# EAGLE design Sch_PowerSupply (EAGLE 7.4.0)
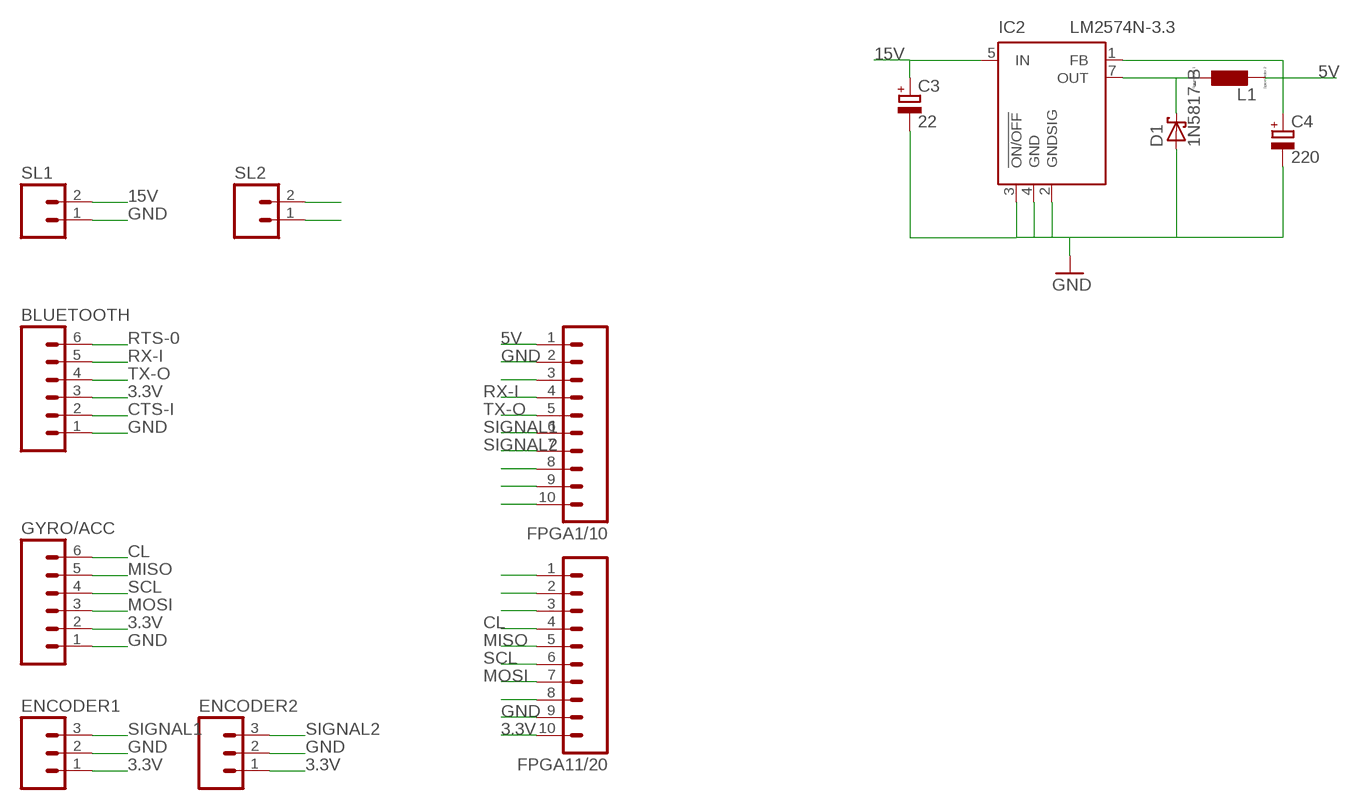
[diagram p0: schematic, sheet 1]

## Parts
BLUETOOTH  M06  [06P]
C3  22  CPOL-EUE5-8.5  [E5-8,5]
C4  220  CPOL-EUE5-8.5  [E5-8,5]
D1  1N5817-B  [DO41-7.6]
ENCODER1  M03  [03P]
ENCODER2  M03  [03P]
FPGA1/10  M10  [10P]
FPGA11/20  M10  [10P]
GYRO/ACC  M06  [06P]
IC2  LM2574N-3.3  [DIL08]
L1  L0204/7  [0204/7]
SL1  M02  [02P]
SL2  M02  [02P]

## Nets
3.3V: BLUETOOTH.3 ENCODER1.1 ENCODER2.1 FPGA11/20.10 GYRO/ACC.2
5V: C4.+ FPGA1/10.1 IC2.1(FB) L1.2 SL2.2
15V: C3.+ IC2.5(IN) SL1.2
CL: FPGA11/20.4 GYRO/ACC.6
CTS-I: BLUETOOTH.2
GND: BLUETOOTH.1 C3.- C4.- D1.A ENCODER1.2 ENCODER2.2 FPGA1/10.2 FPGA11/20.9 GYRO/ACC.1 IC2.2(GNDSIG) IC2.3(!ON/OFF) IC2.4(GND) SL1.1 SL2.1
MISO: FPGA11/20.5 GYRO/ACC.5
MOSI: FPGA11/20.7 GYRO/ACC.3
N$3: D1.C IC2.7(OUT) L1.1
N$7: FPGA11/20.3
N$8: FPGA11/20.2
N$9: FPGA11/20.1
N$10: FPGA1/10.10
N$11: FPGA1/10.9
N$12: FPGA1/10.8
N$16: FPGA1/10.3
N$31: FPGA11/20.8
RTS-0: BLUETOOTH.6
RX-I: BLUETOOTH.5 FPGA1/10.4
SCL: FPGA11/20.6 GYRO/ACC.4
SIGNAL1: ENCODER1.3 FPGA1/10.6
SIGNAL2: ENCODER2.3 FPGA1/10.7
TX-O: BLUETOOTH.4 FPGA1/10.5

## Library data of the parts
BLUETOOTH GYRO/ACC = con-amp-quick:M06: AMP QUICK CONNECTOR; OC_FARNELL: unknown; OC_NEWARK: unknown
C3 C4 = rcl:CPOL-EU: POLARIZED CAPACITOR, European symbol
D1 = diode:1N581*: 1.0A SCHOTTKY BARRIER RECTIFIER Source: http://www.diodes.com/datasheets/ds23001.pdf
ENCODER1 ENCODER2 = con-amp-quick:M03: AMP QUICK CONNECTOR; OC_FARNELL: unknown; OC_NEWARK: unknown
FPGA1/10 FPGA11/20 = con-amp-quick:M10: AMP QUICK CONNECTOR; OC_FARNELL: unknown; OC_NEWARK: unknown
IC2 = linear:LM2574?-*: SIMPLE SWITCHER 0.5A Step-Down Voltage Regulator Source: http://cache.national.com/ds/LM/LM2574.pdf
L1 = eagle-ltspice:L: INDUCTOR, European symbol; SPICEMODEL: NONE; SPICEPREFIX: L
SL1 SL2 = con-amp-quick:M02: AMP QUICK CONNECTOR; OC_FARNELL: unknown; OC_NEWARK: unknown

## Board
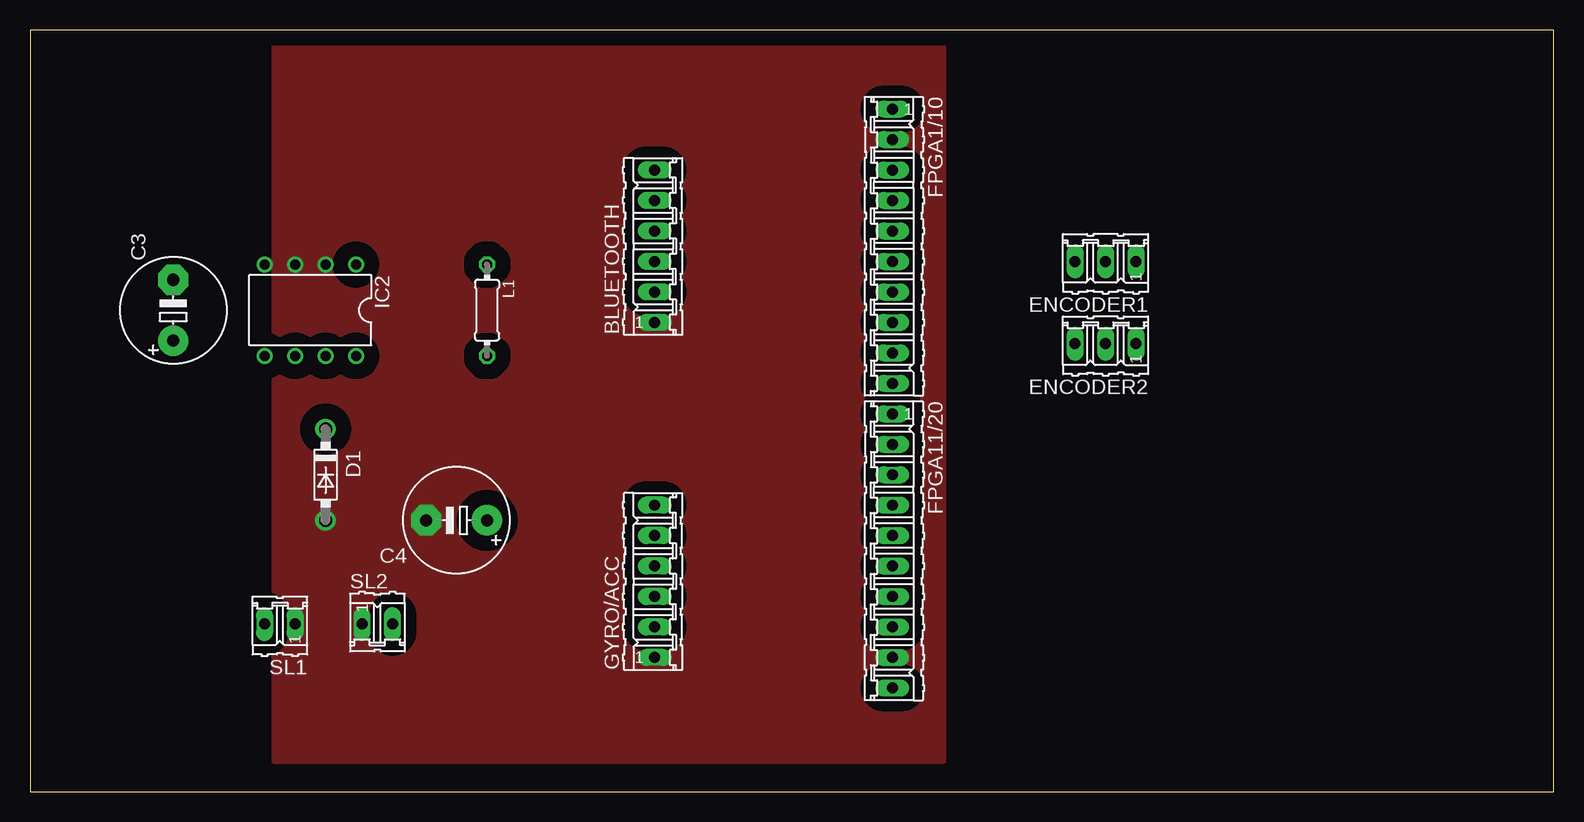
[diagram p1: board, top side]
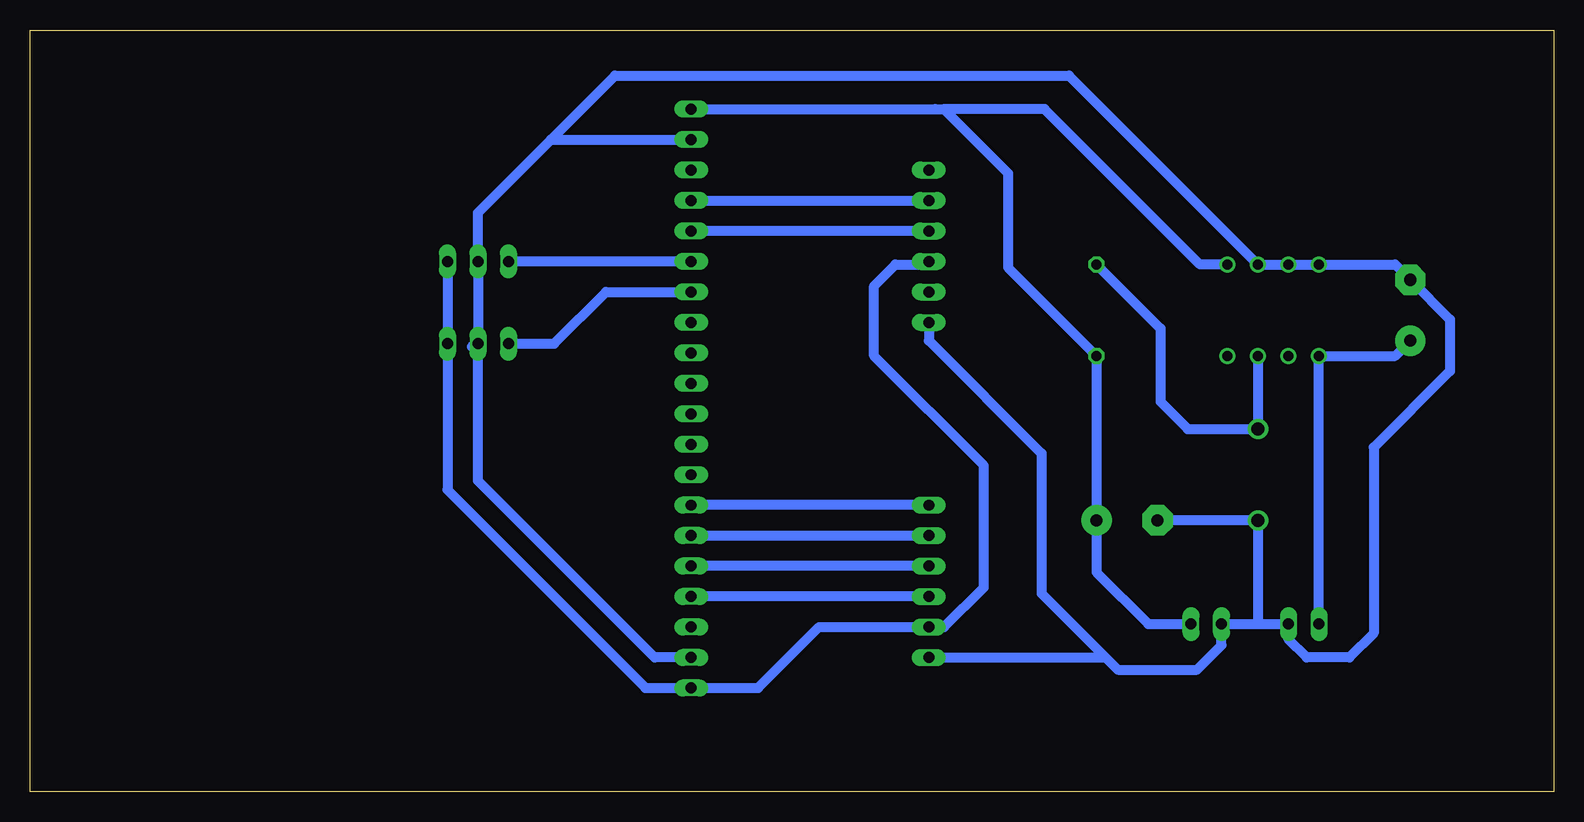
[diagram p2: board, bottom side, seen from below]

Size 127 x 63.5 mm. Coordinates in mm from the lower left corner, seen from the top.
Outline: 0,0 127,0 127,63.5 0,63.5 0,0
Copper layers (1*16): Top 0.035mm / dielectric 1.5mm / Bottom 0.035mm
Design rules "default": minimum track width 10mil, minimum drill 24mil, track to track 8mil, track to pad 8mil, pad to pad 8mil, via to via 8mil, smd to smd 8mil, copper to edge 40mil, drill to drill 8mil, minimum pad ring 10mil, minimum via ring 8mil, stop-mask expansion 4mil, vias tented up to drill 0mil, thermal gap 10mil

### Footprints (pad centres in the part's own frame; a part is rotated, then mirrored left to right if it is on the bottom)
06P = drill 0.914 long: 1 -6.35,0; 2 -3.81,0; 3 -1.27,0; 4 1.27,0; 5 3.81,0; 6 6.35,0
E5-8,5 = drill 1.016 pad 2.54: + -2.54,0 | drill 1.016 pad 2.54 octagon: - 2.54,0
DO41-7.6 = drill 1.1 pad 1.7: A 3.81,0; C -3.81,0
03P = drill 0.914 long: 1 -2.54,0; 2 0,0; 3 2.54,0
10P = drill 0.914 long: 1 -11.43,0; 2 -8.89,0; 3 -6.35,0; 4 -3.81,0; 5 -1.27,0; 6 1.27,0; 7 3.81,0; 8 6.35,0; 9 8.89,0; 10 11.43,0
DIL08 = drill 0.813 pad 1.27: 1 -3.81,-3.81; 2 -1.27,-3.81; 3 1.27,-3.81; 4 3.81,-3.81; 5 3.81,3.81; 6 1.27,3.81; 7 -1.27,3.81; 8 -3.81,3.81
0204/7 = drill 0.813 octagon: 1 -3.81,0; 2 3.81,0
02P = drill 0.914 long: 1 -1.27,0; 2 1.27,0

### Placement (x,y rotation side)
BLUETOOTH  52.07,45.47 90 top
C3  11.94,40.13 90 top
C4  35.56,22.61 180 top
D1  24.64,26.42 270 top
ENCODER1  89.66,44.2 180 top
ENCODER2  89.66,37.34 180 top
FPGA1/10  71.88,45.47 270 top
FPGA11/20  71.88,20.07 270 top
GYRO/ACC  52.07,17.53 90 top
IC2  23.37,40.13 180 top
L1  38.1,40.13 270 top
SL1  20.83,13.97 180 top
SL2  28.96,13.97 0 top

### Tracks (layer width: path | path; a pad name or v marks a point on that pad's centre or on a via)
3.3V
  Bottom 0.813: BLUETOOTH.3 52.32,43.94 54.86,43.94 56.64,42.16 56.64,36.32 47.5,27.18 47.5,17.02 50.8,13.72 GYRO/ACC.2 52.32,13.46 52.58,13.46 52.83,13.72 61.21,13.72 66.29,8.64 FPGA11/20.10 75.69,8.64 92.2,25.15 ENCODER2.1 ENCODER1.1
5V
  Bottom 0.813: FPGA1/10.1 51.56,56.9 50.8,56.9 | 50.8,56.9 45.47,51.56 45.47,43.69 L1.2 C4.+ 38.1,18.29 33.78,13.97 SL2.2 | IC2.1 29.46,43.94 42.42,56.9 50.8,56.9
15V
  Bottom 0.813: SL1.2 IC2.5 13.21,36.32 C3.+
CL
  Bottom 0.813: GYRO/ACC.6 FPGA11/20.4
GND
  Bottom 0.813: 83.57,54.36 89.66,48.26 ENCODER1.2 89.66,37.59 90.17,37.08 89.92,37.08 ENCODER2.2 89.66,25.91 74.93,11.18 FPGA11/20.9 | 83.57,54.36 FPGA1/10.2 | D1.A C4.- | 24.89,43.94 IC2.2 | IC2.2 IC2.3 IC2.4 13.21,43.94 C3.- 8.64,39.37 8.64,35.05 14.99,28.7 14.99,13.21 17.02,11.18 20.57,11.18 22.1,12.7 SL1.1 SL2.1 27.69,12.19 29.72,10.16 36.32,10.16 37.08,10.92 37.34,11.18 | 83.57,54.36 78.23,59.69 40.39,59.69 IC2.2 | 52.07,38.86 52.07,37.59 42.67,28.19 42.67,16.51 37.34,11.18 | 52.32,11.18 37.34,11.18
  pour Top (isolate 1.27, no thermals): 20.32,78.74 20.32,2.54 76.2,2.54 76.2,78.74
MISO
  Bottom 0.813: FPGA11/20.5 GYRO/ACC.5
MOSI
  Bottom 0.813: GYRO/ACC.3 FPGA11/20.7
N$2
  Bottom 0.813: 24.64,22.1 24.64,14.22
N$3
  Bottom 0.813: IC2.7 D1.C 30.48,30.23 32.77,32.51 32.77,38.61 L1.1
RX-I
  Bottom 0.813: FPGA1/10.4 BLUETOOTH.5
SCL
  Bottom 0.813: GYRO/ACC.4 FPGA11/20.6
SIGNAL1
  Bottom 0.813: FPGA1/10.6 ENCODER1.3
SIGNAL2
  Bottom 0.813: ENCODER2.3 83.31,37.34 78.99,41.66 FPGA1/10.7
TX-O
  Bottom 0.813: BLUETOOTH.4 FPGA1/10.5